# EAGLE design cdrbot (EAGLE 6.2)
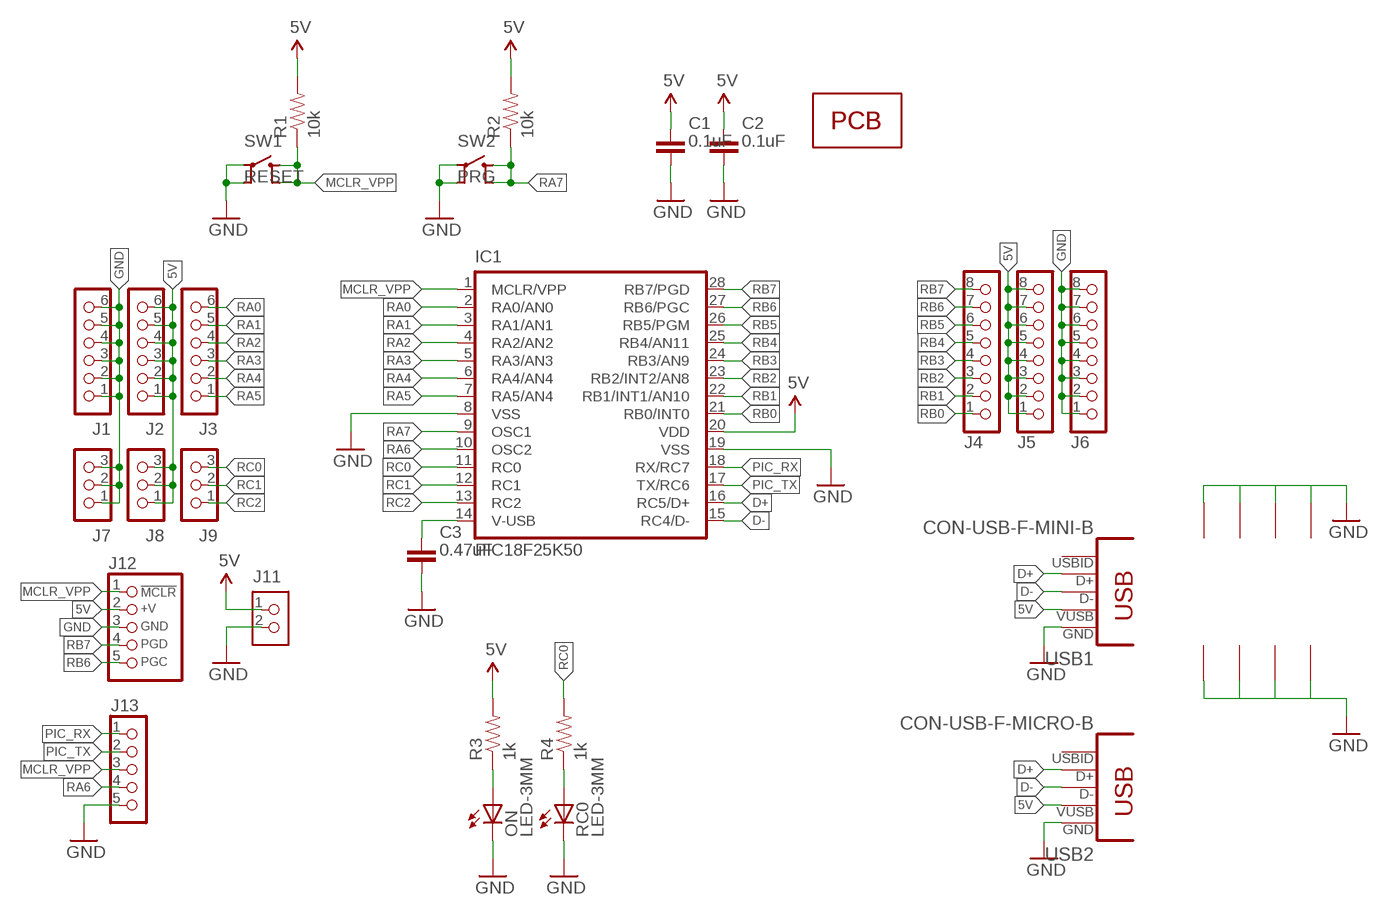
[diagram p0: schematic, sheet 1]

## Parts
C1  0.1uF  CAPACITOR-DECOUPLING  [C025-025X050]
C2  0.1uF  CAPACITOR-DECOUPLING  [C025-025X050]
C3  0.47uF  CAPACITOR-DECOUPLING  [C025-025X050]
IC1  PIC18F25K50  PIC18F2550  [DIL-28]
J1  CON_HEADER_1X06-PTH_M  [M1X06_M]
J2  CON_HEADER_1X06-PTH_M  [M1X06_M]
J3  CON_HEADER_1X06-PTH_M  [M1X06_M]
J4  CON_HEADER_1X08-PTH_M  [M1X08_M]
J5  CON_HEADER_1X08-PTH_M  [M1X08_M]
J6  CON_HEADER_1X08-PTH_M  [M1X08_M]
J7  CON_HEADER_1X03-PTH_M  [M1X03_M]
J8  CON_HEADER_1X03-PTH_M  [M1X03_M]
J9  CON_HEADER_1X03-PTH_M  [M1X03_M]
J11  CON_HEADER_1X02-PTH-M  [M1X02_M]
J12  ICSP  CON_HEADER_PRG_PIC_ICSPB  [HEADER_PRG_1X05_ICSP_B]
J13  CON_HEADER_1X05-PTH_M  [M1X05_M]
ON  LED-3MM  [LED-3MM]
PCB1  PCB_DP_SQUARE-5X5  [PCB5X5]
R1  10k  RESISTOR-1/4W-0.3"  [RTH025W_03]
R2  10k  RESISTOR-1/4W-0.3"  [RTH025W_03]
R3  1k  RESISTOR-1/4W-0.3"  [RTH025W_03]
R4  1k  RESISTOR-1/4W-0.3"  [RTH025W_03]
RC0  LED-3MM  [LED-3MM]
SW1  RESET  SWITCH-MOMPTH  [TACTILE-PTH]
SW2  PRG  SWITCH-MOMPTH  [TACTILE-PTH]
USB1  CON-USB-F-MINI-B  [CONN_USB_MINI-B]
USB2  CON-USB-F-MICRO-B  [CONN_USB_MICRO-B]

## Nets
5V: C1.1 C2.1 IC1.20(VDD) J2.1 J2.2 J2.3 J2.4 J2.5 J2.6 J5.1 J5.2 J5.3 J5.4 J5.5 J5.6 J5.7 J5.8 J8.1 J8.2 J8.3 J11.1 J12.2(+V) R1.2 R2.2 R3.2 USB1.VUSB USB2.P1(VUSB)
D+: IC1.16(RC5/D+) USB1.D+ USB2.P3(D+)
D-: IC1.15(RC4/D-) USB1.D- USB2.P2(D-)
GND: C1.2 C2.2 C3.2 IC1.8(VSS) IC1.19(VSS) J1.1 J1.2 J1.3 J1.4 J1.5 J1.6 J6.1 J6.2 J6.3 J6.4 J6.5 J6.6 J6.7 J6.8 J7.1 J7.2 J7.3 J11.2 J12.3(GND) J13.5 ON.K(C) RC0.K(C) SW1.1 SW1.2 SW2.1 SW2.2 USB1.BODY@1(BODY) USB1.BODY@2(BODY) USB1.BODY@3(BODY) USB1.BODY@4(BODY) USB1.GND USB2.BODY@1(BODY) USB2.BODY@2(BODY) USB2.BODY@3(BODY) USB2.BODY@4(BODY) USB2.P5(GND)
LED1: ON.A R3.1
LED2: R4.1 RC0.A
MCLR_VPP: IC1.1(MCLR/VPP) J12.1(/MCLR) J13.3 R1.1 SW1.3 SW1.4
PIC_RX: IC1.18(RX/RC7) J13.1
PIC_TX: IC1.17(TX/RC6) J13.2
RA0: IC1.2(RA0/AN0) J3.6
RA1: IC1.3(RA1/AN1) J3.5
RA2: IC1.4(RA2/AN2) J3.4
RA3: IC1.5(RA3/AN3) J3.3
RA4: IC1.6(RA4/AN4) J3.2
RA5: IC1.7(RA5/AN4) J3.1
RA6: IC1.10(OSC2) J13.4
RA7: IC1.9(OSC1) R2.1 SW2.3 SW2.4
RB0: IC1.21(RB0/INT0) J4.1
RB1: IC1.22(RB1/INT1/AN10) J4.2
RB2: IC1.23(RB2/INT2/AN8) J4.3
RB3: IC1.24(RB3/AN9) J4.4
RB4: IC1.25(RB4/AN11) J4.5
RB5: IC1.26(RB5/PGM) J4.6
RB6: IC1.27(RB6/PGC) J4.7 J12.5(PGC)
RB7: IC1.28(RB7/PGD) J4.8 J12.4(PGD)
RC0: IC1.11(RC0) J9.3 R4.2
RC1: IC1.12(RC1) J9.2
RC2: IC1.13(RC2) J9.1
VUSB: C3.1 IC1.14(V-USB)
Unconnected: USB1.ID(USBID) USB2.P4(USBID)

## Library data of the parts
C1-C3 = gary:CAPACITOR: Non-Polarized capacitor in various packages
IC1 = gary:PIC18F2550
J1-J3 = gary:CON_HEADER_1X06
J4-J6 = gary:CON_HEADER_1X08
J7-J9 = gary:CON_HEADER_1X03
J11 = gary:CON_HEADER_1X02
J12 = dp_devices:CON_HEADER_PRG_PIC_ICSP: 5-pin PIC In Circuit Serial Programming header
J13 = gary:CON_HEADER_1X05
ON RC0 = gary:LED: Light Emitting Diode
PCB1 = gary:PCB_DP_SQUARE: Dangerous Prototypes Standard Square PCB sizes
R1-R4 = gary:RESISTOR: Resistor Basic schematic elements and footprints for 0603, 1206, and PTH resistors.
SW1 SW2 = gary:SWITCH-MOM
USB1 USB2 = dp_devices:CON-USB-F: USB Female connector

## Board
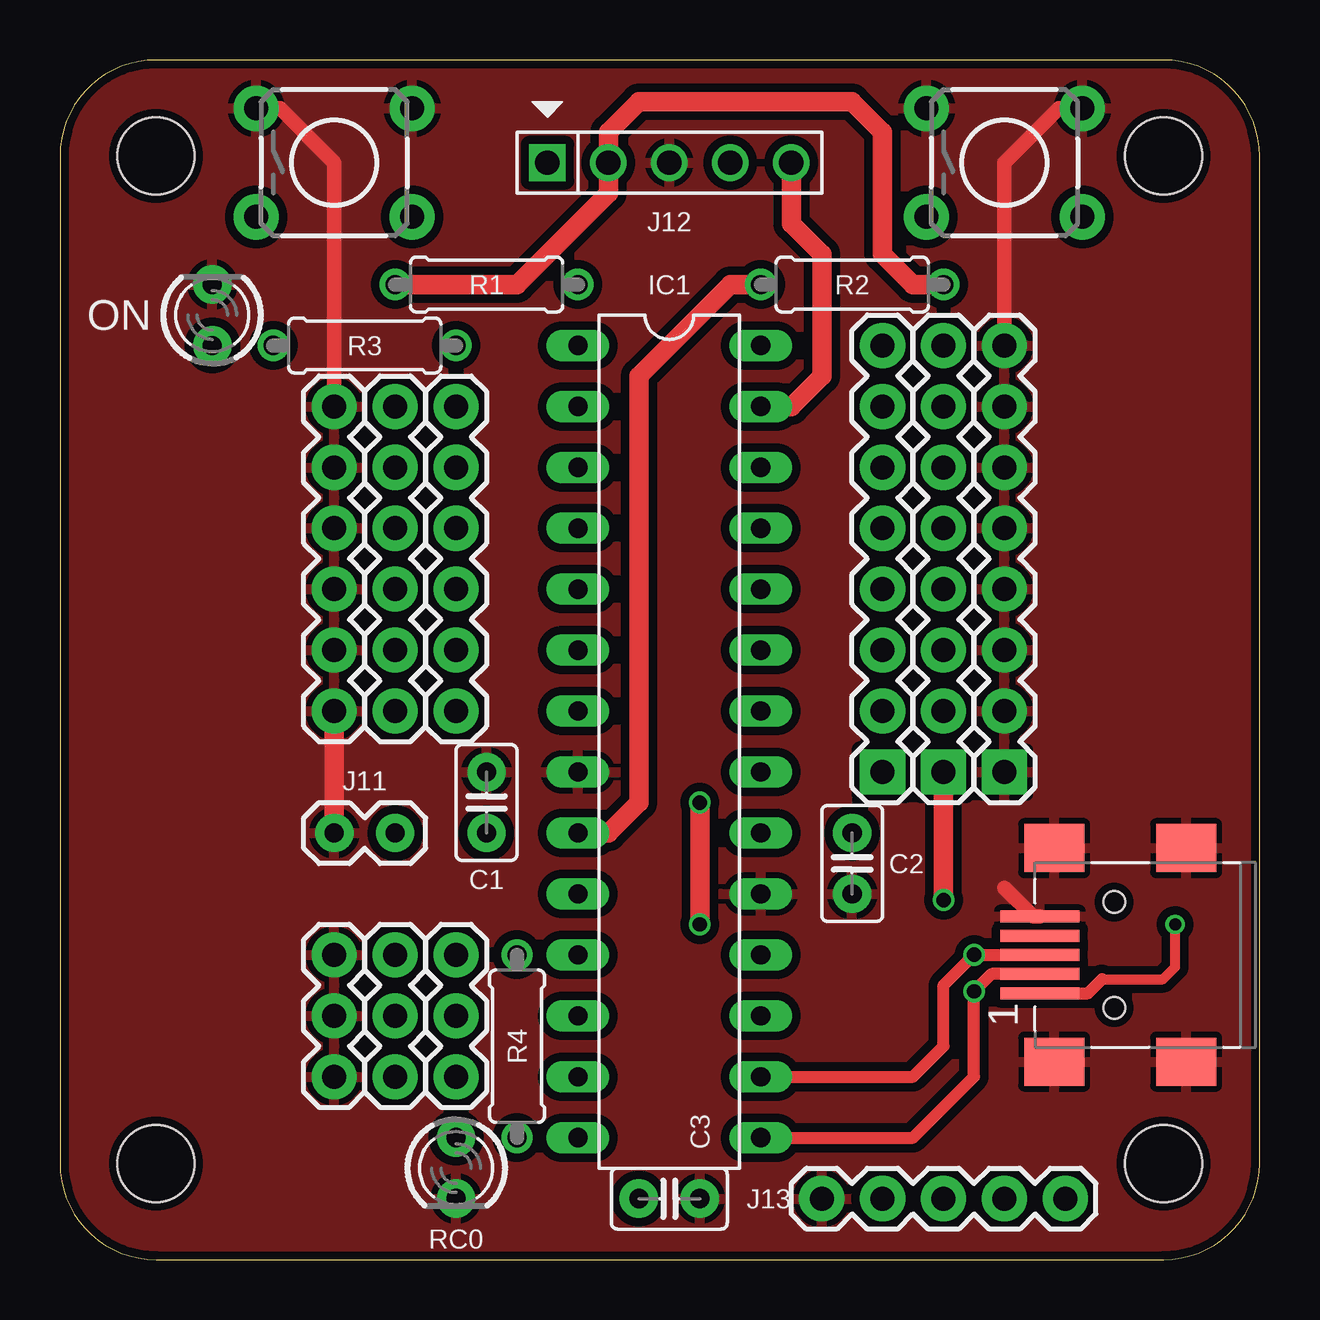
[diagram p1: board, top side]
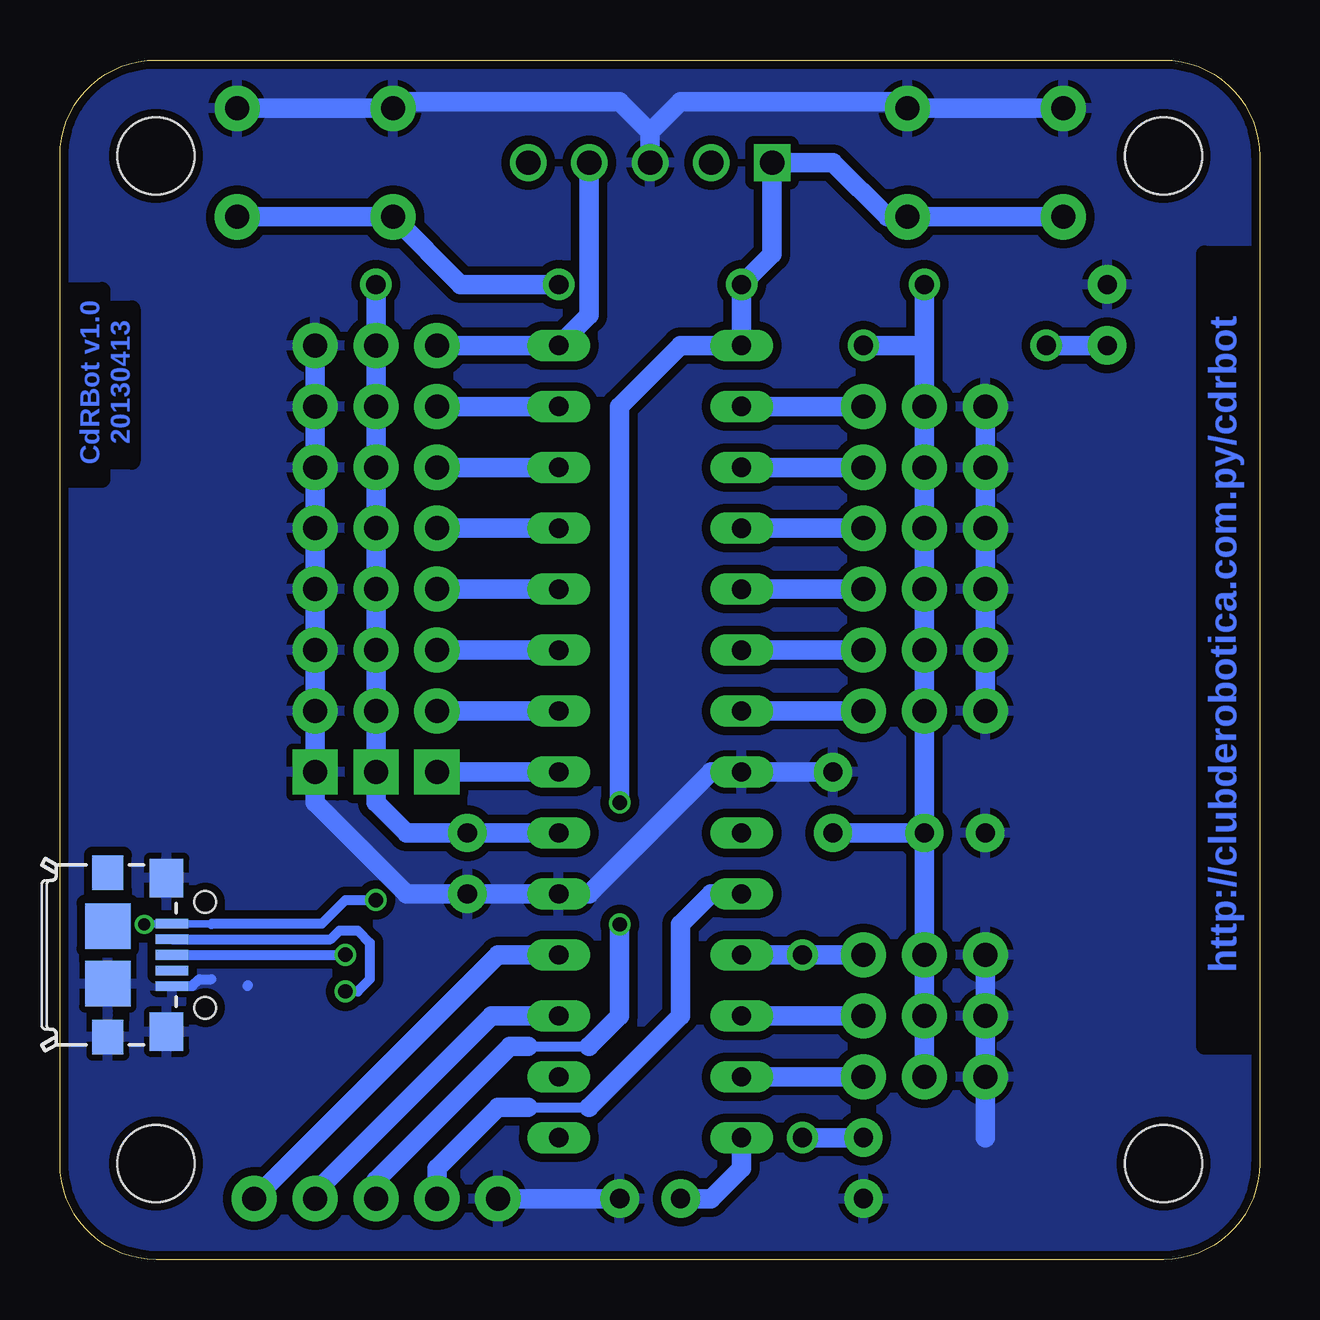
[diagram p2: board, bottom side, seen from below]

Size 50 x 50 mm. Coordinates in mm from the lower left corner, seen from the top.
Copper layers (1*16): Top 0.035mm / dielectric 1.5mm / Bottom 0.035mm
Design rules: minimum track width 6mil, minimum drill 12mil, track to track 6mil, track to pad 6mil, pad to pad 6mil, via to via 6mil, smd to smd 0mil, copper to edge 10mil, drill to drill 10mil, minimum pad ring 10mil, minimum via ring 6mil, stop-mask expansion 2mil, vias tented up to drill 100mil, thermal gap 10mil
bRestrict: area 0,8.9 to 2.3,41.9; area 48.3,32.5 to 50,40.4; area 47,33.3 to 48.3,39.6

### Footprints (pad centres in the part's own frame; a part is rotated, then mirrored left to right if it is on the bottom)
C025-025X050 = drill 0.8 pad 1.6: 1 -1.27,0; 2 1.27,0
DIL-28 = drill 0.8 long: 1 -16.51,-3.81; 2 -13.97,-3.81; 3 -11.43,-3.81; 4 -8.89,-3.81; 5 -6.35,-3.81; 6 -3.81,-3.81; 7 -1.27,-3.81; 8 1.27,-3.81; 9 3.81,-3.81; 10 6.35,-3.81; 11 8.89,-3.81; 12 11.43,-3.81; 13 13.97,-3.81; 14 16.51,-3.81; 15 16.51,3.81; 16 13.97,3.81; 17 11.43,3.81; 18 8.89,3.81; 19 6.35,3.81; 20 3.81,3.81; 21 1.27,3.81; 22 -1.27,3.81; 23 -3.81,3.81; 24 -6.35,3.81; 25 -8.89,3.81; 26 -11.43,3.81; 27 -13.97,3.81; 28 -16.51,3.81
M1X06_M = drill 1 pad 1.88: 1 0,0; 2 2.54,0; 3 5.08,0; 4 7.62,0; 5 10.16,0; 6 12.7,0
M1X08_M = drill 1 pad 1.88 square: 1 0,0 | drill 1 pad 1.88: 2 2.54,0; 3 5.08,0; 4 7.62,0; 5 10.16,0; 6 12.7,0; 7 15.24,0; 8 17.78,0
M1X03_M = drill 1 pad 1.88: 1 0,0; 2 2.54,0; 3 5.08,0
M1X02_M = drill 0.8 pad 1.6: 1 -1.27,0; 2 1.27,0
HEADER_PRG_1X05_ICSP_B = drill 1.016 square: 1 -5.08,0 | drill 1.016: 2 -2.54,0; 3 0,0; 4 2.54,0; 5 5.08,0
M1X05_M = drill 1 pad 1.88: 1 0,0; 2 2.54,0; 3 5.08,0; 4 7.62,0; 5 10.16,0
LED-3MM = drill 0.8 pad 1.6: A -1.27,0; K 1.27,0
PCB5X5 = hole 3.2: 4,4; 46,4; 46,46; 4,46
RTH025W_03 = drill 0.8: 1 -3.81,0; 2 3.81,0
TACTILE-PTH = drill 1 pad 1.88: 1 -3.251,2.261; 2 3.251,2.261; 3 -3.251,-2.261; 4 3.251,-2.261
CONN_USB_MINI-B = smd 2 x 2.5: BODY@1 -4.45,2.5; BODY@2 4.45,2.5; BODY@3 4.45,-3; BODY@4 -4.45,-3 | smd 0.5 x 3.3: D+ 0,3.1; D- -0.8,3.1; GND 1.6,3.1; ID 0.8,3.1; VUSB -1.6,3.1 | hole 0.9: -2.2,0; 2.2,0
CONN_USB_MICRO-B = smd 1.6 x 1.4: BODY@1 -3.2,2.45; BODY@2 3.2,2.45 | smd 1.45 x 1.3: BODY@3 3.425,0; BODY@6 -3.425,0 | smd 1.9 x 1.9: BODY@4 1.2,0; BODY@5 -1.2,0 | smd 0.4 x 1.35: P1 -1.3,2.675; P2 -0.65,2.675; P3 0,2.675; P4 0.65,2.675; P5 1.3,2.675

### Placement (x,y rotation side)
C1  17.78,19.05 90 top
C2  33.02,16.51 270 top
C3  25.4,2.54 0 top
IC1  25.4,21.59 270 top
J1  11.43,22.86 90 top
J2  13.97,22.86 90 top
J3  16.51,22.86 90 top
J4  34.29,20.32 90 top
J5  36.83,20.32 90 top
J6  39.37,20.32 90 top
J7  11.43,7.62 90 top
J8  13.97,7.62 90 top
J9  16.51,7.62 90 top
J11  12.7,17.78 180 top
J12  25.4,45.72 0 top
J13  41.91,2.54 180 top
ON  6.35,39.37 90 top
PCB1  0,0 0 top
R1  17.78,40.64 180 top
R2  33.02,40.64 0 top
R3  12.7,38.1 0 top
R4  19.05,8.89 90 top
RC0  16.51,3.81 270 top
SW1  11.43,45.72 0 top
SW2  39.37,45.72 0 top
USB1  43.94,12.7 90 top
USB2  48.01,12.7 270 bottom

### Tracks (layer width: path | path; a pad name or v marks a point on that pad's centre or on a via)
5V  (via drill 0.5, 0.6)
  Top 0.406: 43.43,11.68 45.97,11.68 46.48,12.19 v46.48,13.97
  Top 0.508: USB1.VUSB 42.85,11.1 43.43,11.68
  Top 0.813: R1.2 19.05,40.64 22.86,44.45 J12.2 22.86,46.99 24.13,48.26 33.02,48.26 34.29,46.99 34.29,41.91 35.56,40.64 R2.2 | v36.83,14.99 J5.1
  Bottom 0.305: v46.48,13.97 46.45,14 USB2.P1 43.72,14 43.69,13.97
  Bottom 0.406: v36.83,14.99 38.1,14.99 39.09,14 43.66,14 43.69,13.97
  Bottom 0.813: R1.2 13.97,38.1 | 13.97,38.1 J2.6 J2.5 J2.4 J2.3 J2.2 J2.1 J11.1 | IC1.20 C2.1 35.56,17.78 36.83,19.05 J5.1 J5.2 J5.3 J5.4 J5.5 J5.6 J5.7 J5.8 R2.2 | J11.1 J8.3 J8.2 J8.1 | J11.1 C1.1 | R3.2 13.97,38.1
D+  (via drill 0.6)
  Top 0.508: IC1.16 35.56,7.62 36.83,8.89 36.83,11.43 v38.1,12.7 USB1.D+
  Bottom 0.406: USB2.P3 v38.1,12.7
D-  (via drill 0.6)
  Top 0.508: IC1.15 35.56,5.08 38.1,7.62 v38.1,11.18 38.82,11.9 USB1.D-
  Bottom 0.406: USB2.P2 38.72,13.35 38.35,13.72 37.59,13.72 37.08,13.21 37.08,11.68 37.59,11.18 v38.1,11.18
GND
  Top 0.61: SW1.1 9.17,47.98 11.43,45.72 J1.6 | J6.8 39.37,45.72 41.63,47.98 SW2.2 | USB1.GND 40.56,14.3 39.37,15.49
  Top 0.813: J1.1 J11.2
  Bottom 0.406: 42.19,11.4 42.16,11.43 | USB2.P5 44.48,11.4 44.2,11.68 43.69,11.68
  Bottom 0.813: J1.6 J1.5 J1.4 J1.3 J1.2 J1.1 | J7.3 J7.2 J7.1 11.43,5.08 | J6.8 J6.7 J6.6 J6.5 J6.4 J6.3 J6.2 J6.1 39.37,19.05 35.56,15.24 C2.2 IC1.19 27.94,15.24 22.86,20.32 IC1.8 C1.2 | SW1.1 SW1.2 14.96,47.98 15.24,48.26 24.13,48.26 25.4,46.99 | SW2.2 SW2.1 35.84,47.98 35.56,48.26 26.67,48.26 25.4,46.99 | J12.3 25.4,46.99 | J13.5 C3.2
  pour Bottom (isolate 0.356): 0,0 0,50.8 50.8,50.8 50.8,0
  pour Top (isolate 0.356): 0,0 0,50.8 50.8,50.8 50.8,0
LED1
  Bottom 0.813: R3.1 ON.A
LED2
  Bottom 0.813: R4.1 RC0.A
MCLR_VPP  (via drill 0.6)
  Top 0.813: v26.67,13.97 v26.67,19.05
  Bottom 0.406: 30.48,8.89 27.94,8.89
  Bottom 0.813: J13.3 36.83,3.3 31.24,8.89 30.48,8.89 | 27.94,8.89 26.67,10.16 v26.67,13.97 | v26.67,19.05 26.67,35.56 24.13,38.1 IC1.1 R1.1 20.32,41.91 J12.1 17.78,45.72 15.52,43.46 SW1.4 SW1.3
PIC_RX
  Bottom 0.813: J13.1 31.75,12.7 IC1.18
PIC_TX
  Bottom 0.813: IC1.17 32,10.16 39.37,2.79 J13.2
RA0
  Bottom 0.813: J3.6 IC1.2
RA1
  Bottom 0.813: IC1.3 J3.5
RA2
  Bottom 0.813: IC1.4 J3.4
RA3
  Bottom 0.813: IC1.5 J3.3
RA4
  Bottom 0.813: J3.2 IC1.6
RA5
  Bottom 0.813: IC1.7 J3.1
RA6
  Bottom 0.406: 30.48,6.35 27.94,6.35
  Bottom 0.813: J13.4 34.29,3.81 31.75,6.35 30.48,6.35 | 27.94,6.35 24.13,10.16 24.13,13.97 22.86,15.24 IC1.10
RA7
  Top 0.813: R2.1 27.94,40.64 24.13,36.83 24.13,19.05 22.86,17.78 IC1.9
  Bottom 0.813: SW2.4 SW2.3 33.3,40.64 R2.1
RB0
  Bottom 0.813: J4.1 IC1.21
RB1
  Bottom 0.813: IC1.22 J4.2
RB2
  Bottom 0.813: J4.3 IC1.23
RB3
  Bottom 0.813: IC1.24 J4.4
RB4
  Bottom 0.813: J4.5 IC1.25
RB5
  Bottom 0.813: IC1.26 J4.6
RB6
  Top 0.813: J12.5 30.48,43.18 31.75,41.91 31.75,36.83 30.48,35.56 IC1.27
  Bottom 0.813: J4.7 IC1.27
RB7
  Bottom 0.813: J4.8 IC1.28 27.94,39.37 J12.4
RC0
  Bottom 0.813: J9.3 R4.2 IC1.11
RC1
  Bottom 0.813: J9.2 IC1.12
RC2
  Bottom 0.813: J9.1 IC1.13
VUSB
  Bottom 0.813: C3.1 22.86,2.54 21.59,3.81 IC1.14

### Text on the board
Bottom: 20130413 | CdRBot v1.0 | http://clubderobotica.com.py/cdrbot
tValues: ICSP | RESET | PRG | SW1 | SW2 | RB7 | RB7 | RA0 | RA0 | RB6 | RB6 | RA1 | RA1 | RB5 | RB5 | RA2 | RA2 | RB4 | RB4 | RA3 | RA3 | RB3 | RB3 | RA4 | RA4 | RB2 | RB2 | RA5 | RA5 | RB1 | RB1 | RB0 | RB0 | VSS | VDD | + | - | RC0 | PIC_RX | PROGRAMACION | RC1 | PIC_TX | RC2 | VSS | VDD | GND | GND | MCLR | PIC_TX | PIC_RX